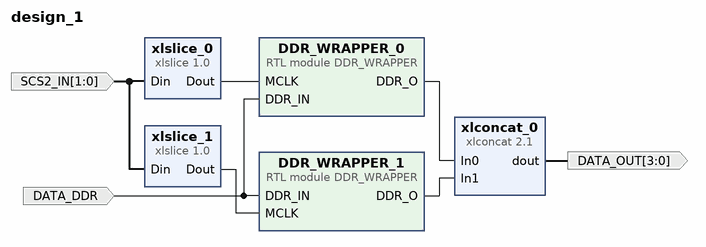
[diagram p0: block diagram of the top level]
# Vivado block design design_1, xc7z020clg400-1, Vivado 2019.1
create_bd_design design_1

create_bd_port -dir I -from 1 -to 0 -type clk SCS2_IN
set_property -dict {CONFIG.FREQ_HZ 460000000} [get_bd_ports SCS2_IN]
create_bd_port -dir I DATA_DDR
create_bd_port -dir O -from 3 -to 0 DATA_OUT

create_bd_cell -type module -reference DDR_WRAPPER DDR_WRAPPER_0
create_bd_cell -type module -reference DDR_WRAPPER DDR_WRAPPER_1
create_bd_cell -type ip -vlnv xilinx.com:ip:xlslice:1.0 xlslice_0
set_property -dict {CONFIG.DIN_FROM 0 CONFIG.DIN_TO 0 CONFIG.DIN_WIDTH 2} [get_bd_cells xlslice_0]
create_bd_cell -type ip -vlnv xilinx.com:ip:xlslice:1.0 xlslice_1
set_property -dict {CONFIG.DIN_FROM 1 CONFIG.DIN_TO 1 CONFIG.DIN_WIDTH 2} [get_bd_cells xlslice_1]
create_bd_cell -type ip -vlnv xilinx.com:ip:xlconcat:2.1 xlconcat_0
set_property -dict {CONFIG.IN0_WIDTH 2 CONFIG.IN1_WIDTH 2} [get_bd_cells xlconcat_0]

# ---- connections ----

connect_bd_net [get_bd_ports SCS2_IN] [get_bd_pins xlslice_0/Din] [get_bd_pins xlslice_1/Din]
connect_bd_net [get_bd_pins xlslice_1/Dout] [get_bd_pins DDR_WRAPPER_1/MCLK]
connect_bd_net [get_bd_pins xlslice_0/Dout] [get_bd_pins DDR_WRAPPER_0/MCLK]
connect_bd_net [get_bd_ports DATA_DDR] [get_bd_pins DDR_WRAPPER_0/DDR_IN] [get_bd_pins DDR_WRAPPER_1/DDR_IN]
connect_bd_net [get_bd_pins DDR_WRAPPER_0/DDR_O] [get_bd_pins xlconcat_0/In0]
connect_bd_net [get_bd_pins DDR_WRAPPER_1/DDR_O] [get_bd_pins xlconcat_0/In1]
connect_bd_net [get_bd_pins xlconcat_0/dout] [get_bd_ports DATA_OUT]

validate_bd_design
save_bd_design
